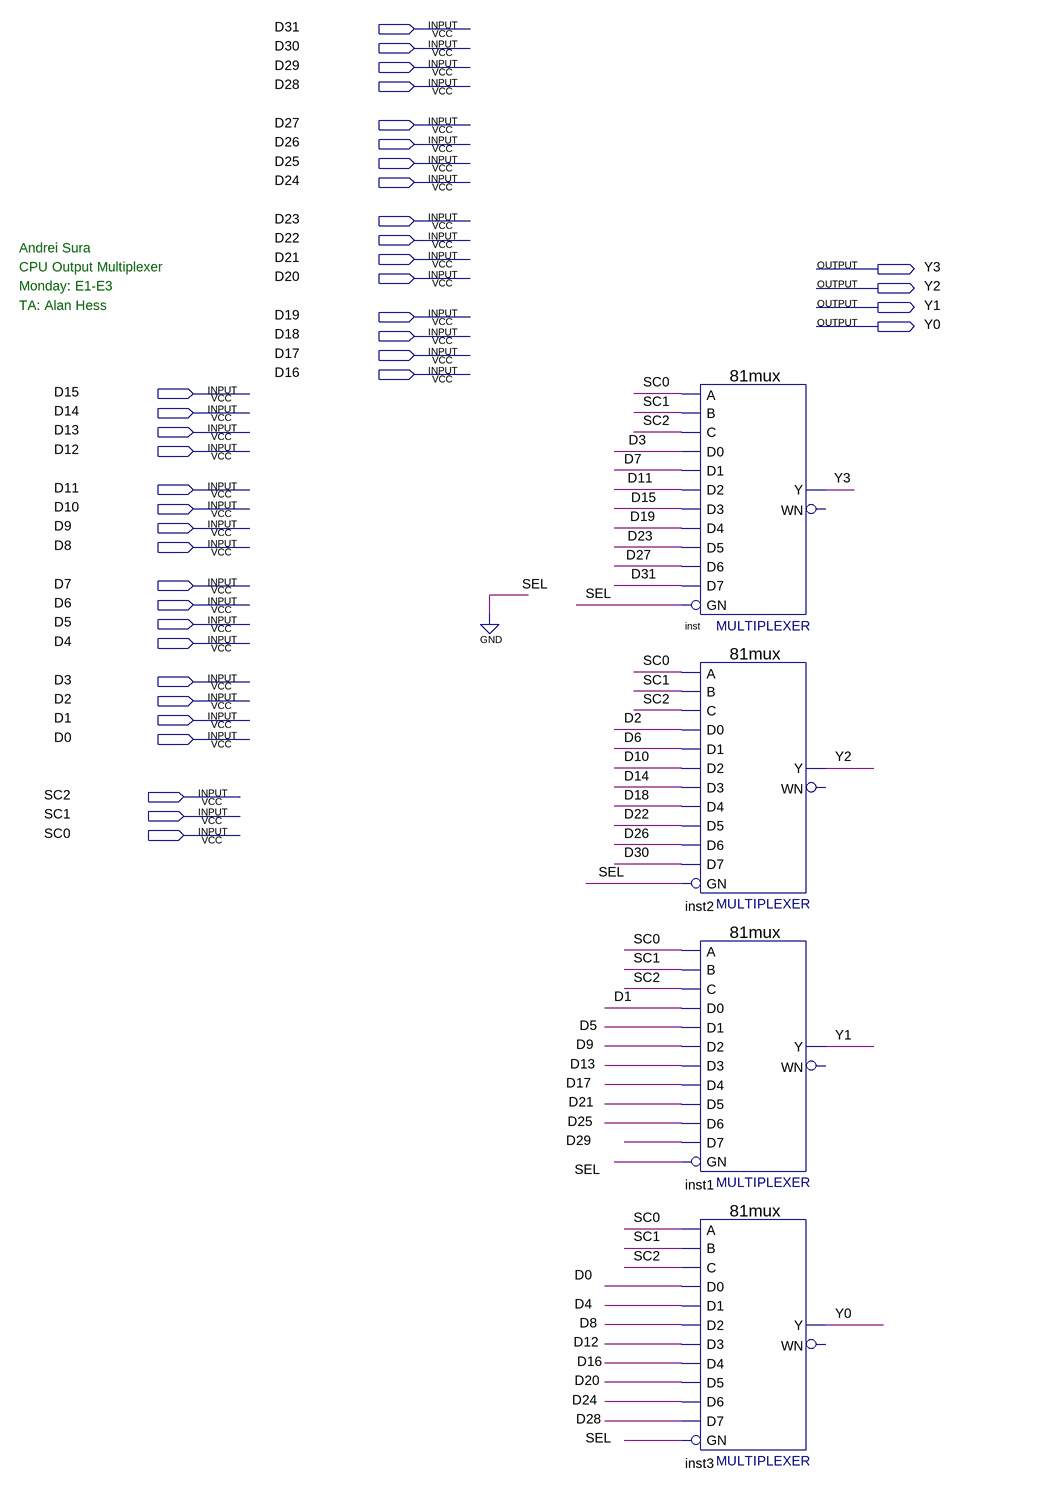
[diagram p0: schematic sheet]
// Quartus schematic out_mux.bdf as structural Verilog: 4 symbols, 39 pins
module out_mux (
  input  D31,
  input  D30,
  input  D29,
  input  D28,
  input  D27,
  input  D26,
  input  D25,
  input  D24,
  input  D23,
  input  D22,
  input  D21,
  input  D20,
  input  D19,
  input  D18,
  input  D17,
  input  D16,
  input  D15,
  input  D14,
  input  D13,
  input  D12,
  input  D11,
  input  D10,
  input  D9,
  input  D8,
  input  D7,
  input  D6,
  input  D5,
  input  D4,
  input  D3,
  input  D2,
  input  D1,
  input  D0,
  input  SC2,
  input  SC1,
  input  SC0,
  output Y3,
  output Y2,
  output Y1,
  output Y0
);

  \81mux  inst (
    .C(SC2), .D1(D7), .D0(D3), .D5(D23), .D4(D19), .D2(D11), .D3(D15), .GN(1'b0), .D7(D31), .D6(D27),
    .A(SC0), .B(SC1), .Y(Y3));  // open: WN
  \81mux  inst2 (
    .C(SC2), .D1(D6), .D0(D2), .D5(D22), .D4(D18), .D2(D10), .D3(D14), .GN(1'b0), .D7(D30), .D6(D26),
    .A(SC0), .B(SC1), .Y(Y2));  // open: WN
  \81mux  inst1 (
    .C(SC2), .D1(D5), .D0(D1), .D5(D21), .D4(D17), .D2(D9), .D3(D13), .GN(1'b0), .D7(D29), .D6(D25), .A(SC0),
    .B(SC1), .Y(Y1));  // open: WN
  \81mux  inst3 (
    .C(SC2), .D1(D4), .D0(D0), .D5(D20), .D4(D16), .D2(D8), .D3(D12), .GN(1'b0), .D7(D28), .D6(D24), .A(SC0),
    .B(SC1), .Y(Y0));  // open: WN

  // Notes on the sheet:
  //   Andrei Sura
  //   CPU Output Multiplexer
  //   Monday: E1-E3
  //   TA: Alan Hess
endmodule
